# EasyEDA Pro project easy_eda_proj.eprj, schematic Schematic1
Board Name: Board1; Create Date: 2025-11-26; Page Name: P1; Project Name: musclemap_pcb_revised; Schematic Name: Schematic1; Update Date: 2025-12-25; Company: DWAN; Drawn: DWAN; Page Size: A4; Version: V1.0
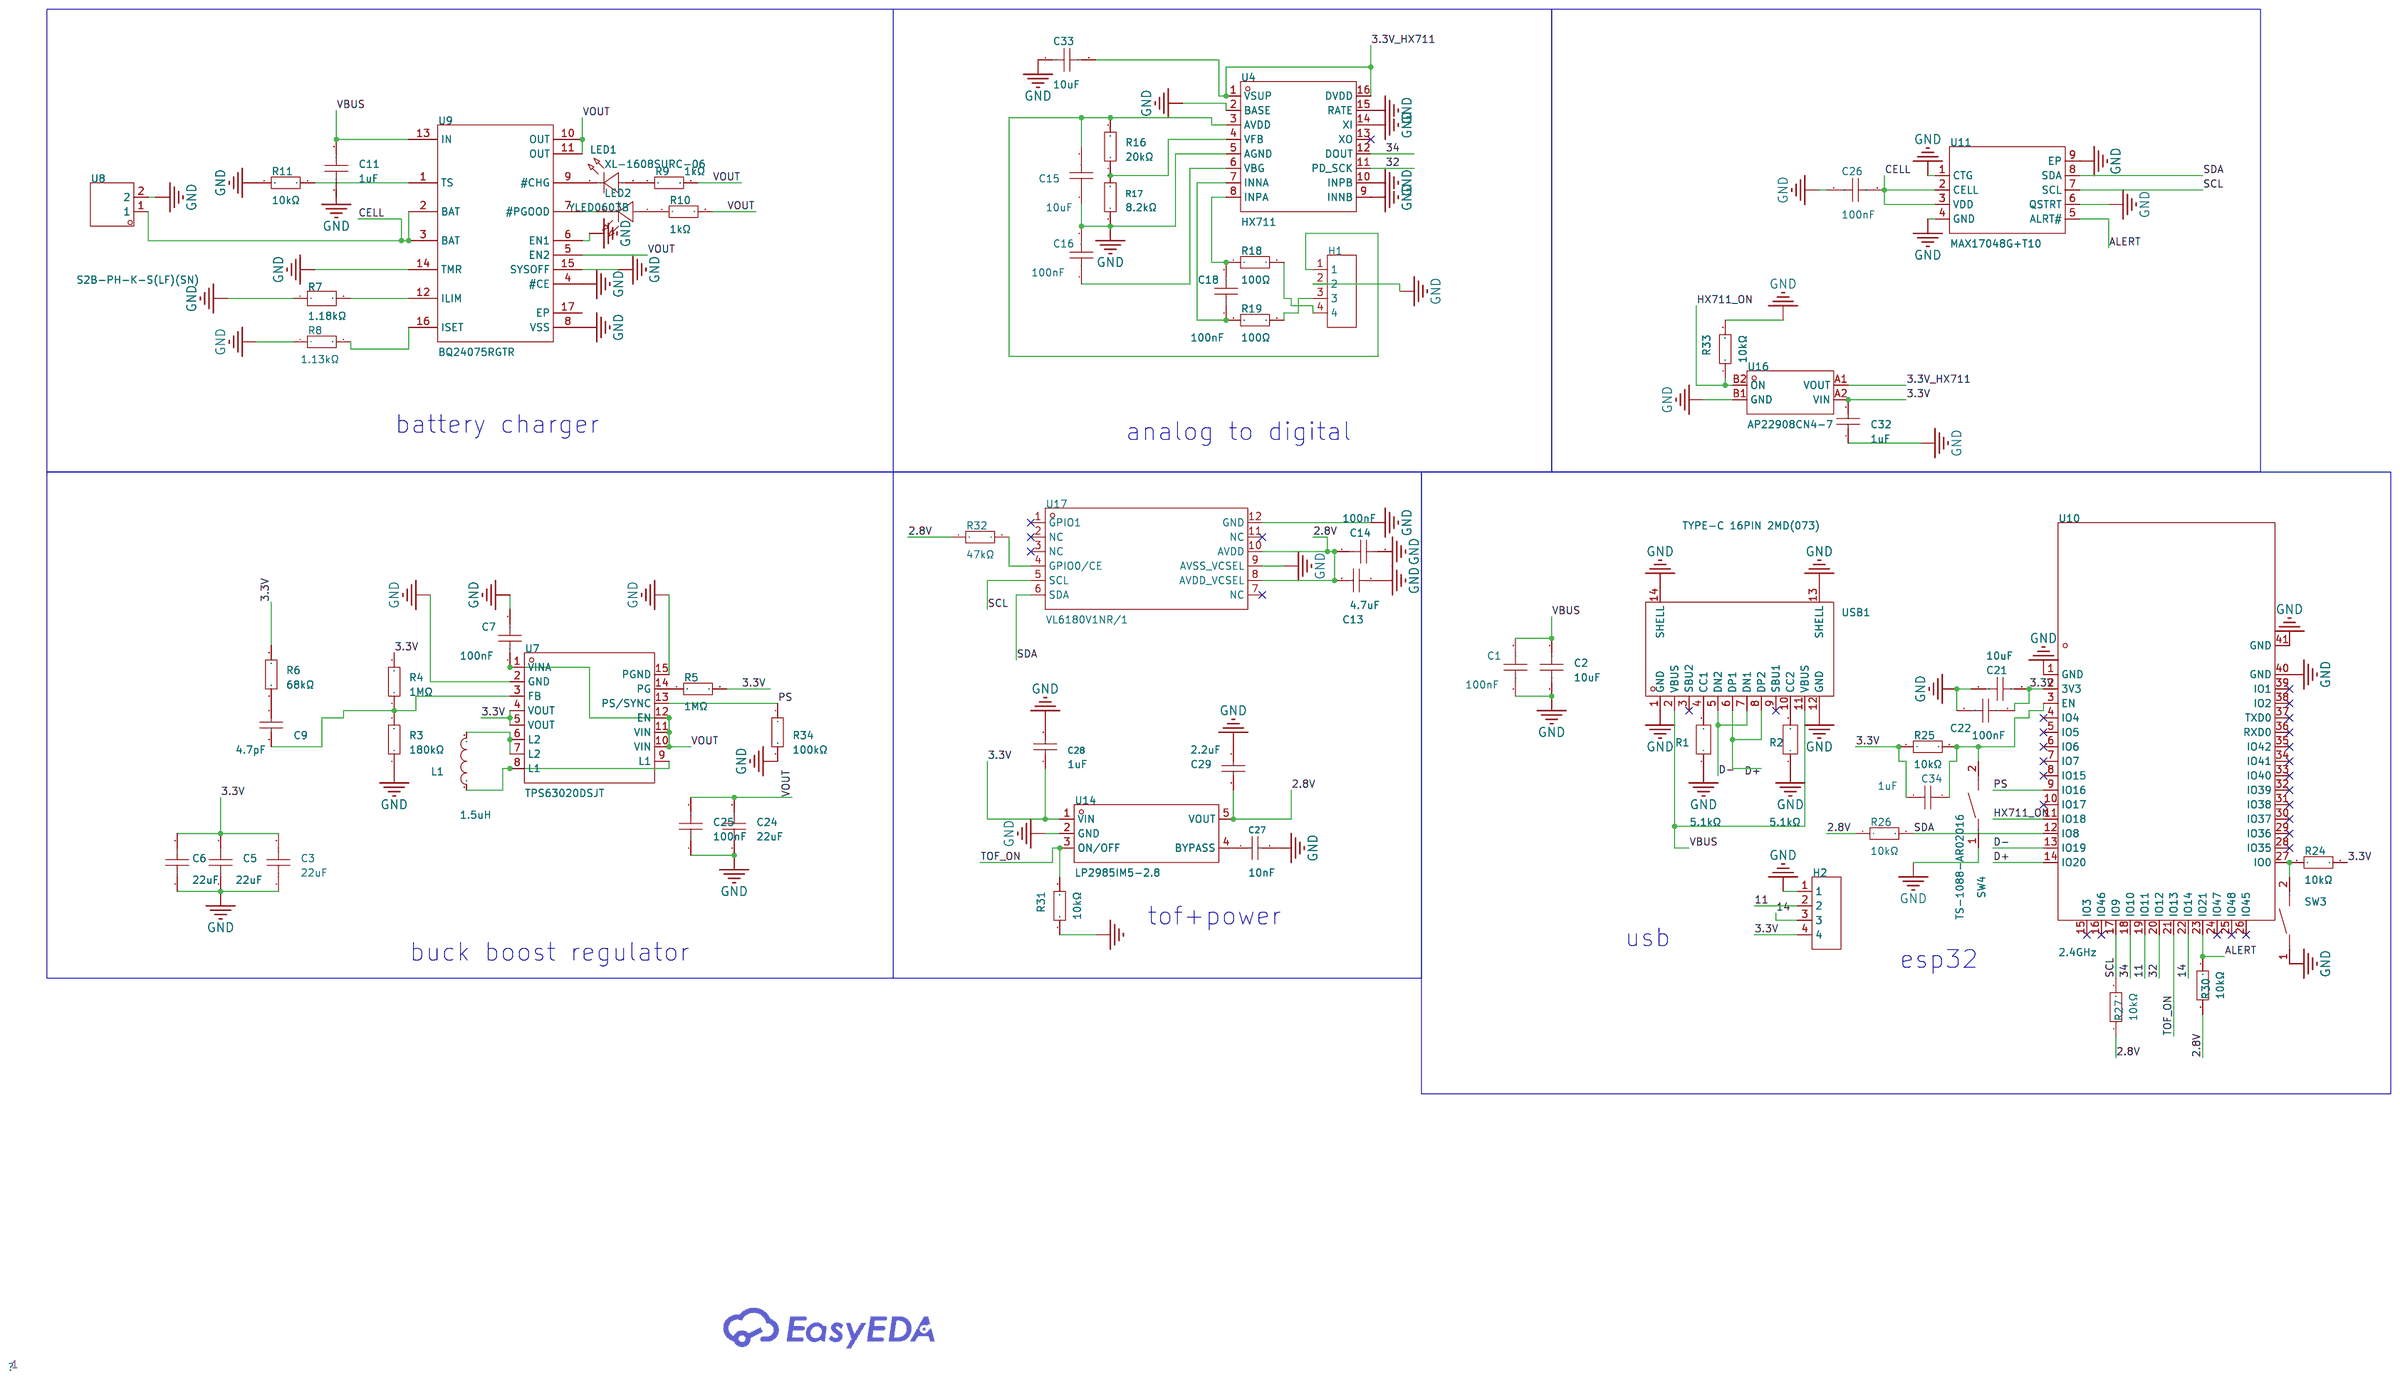
[diagram p0: schematic sheet]

## Parts
C1  100nF  [C0603]
C2  10uF  [C0805]
C3  22uF  [C0603]
C5  22uF  [C0603]
C6  22uF  [C0603]
C7  100nF  [C0603]
C9  4.7pF  [C0603]
C11  1uF  [C0603]
C13  4.7uF  [C0805]
C14  100nF  [C0603]
C15  10uF  [C0805]
C16  100nF  [C0603]
C18  100nF  [C0603]
C21  10uF  [C0805]
C22  100nF  [C0603]
C24  22uF  [C0603]
C25  100nF  [C0402]
C26  100nF  [C0603]
C27  10nF  [C0603]
C28  1uF  [C0805]
C29  2.2uF  [C0603]
C32  1uF  [C0402]
C33  10uF  [C0603]
C34  1uF  [C0402]
H1  -  [CONN-TH_B4B-XH-A-LF-SN]
H2  -  [CONN-TH_B4B-XH-A-LF-SN]
L1  1.5uH  [IND-SMD_L2.5-W2.0_MEKK2520TR47M]
LED1  XL-1608SURC-06  [LED0603-RD_RED]
LED2  YLED0603B  [LED0603-FD]
R1  5.1kΩ  [R0603]
R2  5.1kΩ  [R0603]
R3  180kΩ  [R0603]
R4  1MΩ  [R0603]
R5  1MΩ  [R0603]
R6  68kΩ  [R0603]
R7  1.18kΩ  [R0603]
R8  1.13kΩ  [R0603]
R9  1kΩ  [R0603]
R10  1kΩ  [R0603]
R11  10kΩ  [R0603]
R16  20kΩ  [R0603]
R17  8.2kΩ  [R0603]
R18  100Ω  [R0603]
R19  100Ω  [R0603]
R24  10kΩ  [R0603]
R25  10kΩ  [R0603]
R26  10kΩ  [R0603]
R27  10kΩ  [R0603]
R30  10kΩ  [R0603]
R31  10kΩ  [R0603]
R32  47kΩ  [R0603]
R33  10kΩ  [R0603]
R34  100kΩ  [R0402]
SW3  TS-1088-AR02016  [SW-SMD_L3.9-W3.0-P4.45]
SW4  TS-1088-AR02016  [SW-SMD_L3.9-W3.0-P4.45]
U4  HX711  [SOP-16_L10.0-W3.9-P1.27-LS6.0-BL]
U7  TPS63020DSJT  [VSON-14_L4.0-W3.0-P0.50-BL-EP_TI_DSJ]
U8  S2B-PH-K-S(LF)(SN)  [CONN-TH_S2B-PH-K-S-LF-SN]
U9  BQ24075RGTR  [QFN-16_L3.0-W3.0-P0.50-TL-EP1.7]
U10  2.4GHz  [WIRELM-SMD_ESP32-S3-WROOM-1]
U11  MAX17048G+T10  [TDFN-8_L2.0-W2.0-P0.50-BL-EP1.2]
U14  LP2985IM5-2.8  [SOT-23-5_L3.0-W1.6-P0.95-LS2.8-BR]
U16  AP22908CN4-7  [X1-WLB0909-4_L0.9-W0.9-R2-C2-P0.55-BR]
U17  VL6180V1NR/1  [LGA-12_L4.8-W2.8-P0.75-BL]
USB1  TYPE-C 16PIN 2MD(073)  [USB-C-SMD_TYPE-C-6PIN-2MD-073]

## Library data of the parts
C1 C7 C14 C16 C18 C22 C26 = CC0603KRX7R9BB104: Capacitance:100nF Tolerance:±10% Tolerance:±10% Voltage Rating:50V Temperature Coefficient:X7R; LCSC Part Name: 100nF ±10% 50V; Supplier Part: C14663; Manufacturer: YAGEO(国巨); Supplier Footprint: 0603; JLCPCB Part Class: Basic Part; Datasheet: https://item.szlcsc.com/datasheet/CC0603KRX7R9BB104/15331.html; Supplier: LCSC; Tolerance: ±10%; Voltage Rating: 50V; Temperature Coefficient: X7R
C2 C15 C21 = CL21A106KAYNNNE_C15850: Capacitance:10uF Tolerance:±10% Tolerance:±10% Voltage Rating:25V Temperature Coefficient:X5R; LCSC Part Name: 10uF ±10% 25V; Supplier Part: C15850; Manufacturer: SAMSUNG(三星); Manufacturer Part: CL21A106KAYNNNE; Supplier Footprint: 0805; JLCPCB Part Class: Basic Part; Datasheet: https://item.szlcsc.com/datasheet/CL21A106KAYNNNE/16532.html; Supplier: LCSC; Tolerance: ±10%; Voltage Rating: 25V; Temperature Coefficient: X5R
C3 C5 C6 C24 = CL10A226MP8NUNE: Capacitance:22uF Tolerance:±20% Tolerance:±20% Voltage Rating:10V Temperature Coefficient:X5R; LCSC Part Name: 22uF ±20% 10V; Supplier Part: C86295; Manufacturer: SAMSUNG(三星); Supplier Footprint: 0603; JLCPCB Part Class: Extended Part; Datasheet: https://item.szlcsc.com/datasheet/CL10A226MP8NUNE/87471.html; Supplier: LCSC; Tolerance: ±20%; Voltage Rating: 10V; Temperature Coefficient: X5R
C9 = 0603CG4R7C500NT: Capacitance:4.7pF Voltage Rating:50V Temperature Coefficient:C0G; LCSC Part Name: ±0.25pF 4.7pF 50V; Supplier Part: C1669; Manufacturer: FH(风华); Supplier Footprint: 0603; JLCPCB Part Class: Extended Part; Datasheet: https://item.szlcsc.com/datasheet/0603CG4R7C500NT/2021.html; Supplier: LCSC; Voltage Rating: 50V; Temperature Coefficient: C0G
C11 = CL10A105KB8NNNC: Capacitance:1uF Tolerance:±10% Tolerance:±10% Voltage Rating:50V Temperature Coefficient:X5R; LCSC Part Name: 1uF ±10% 50V; Supplier Part: C15849; Manufacturer: SAMSUNG(三星); Supplier Footprint: 0603; JLCPCB Part Class: Basic Part; Datasheet: https://item.szlcsc.com/datasheet/CL10A105KB8NNNC/16531.html; Supplier: LCSC; Tolerance: ±10%; Voltage Rating: 50V; Temperature Coefficient: X5R
C13 = CL21A475KBQNNNE: Capacitance:4.7uF Tolerance:±10% Tolerance:±10% Voltage Rating:50V Temperature Coefficient:X5R; LCSC Part Name: 4.7uF ±10% 50V; Supplier Part: C98192; Manufacturer: SAMSUNG(三星); Supplier Footprint: 0805; JLCPCB Part Class: Extended Part; Datasheet: https://item.szlcsc.com/datasheet/CL21A475KBQNNNE/99401.html; Supplier: LCSC; Tolerance: ±10%; Voltage Rating: 50V; Temperature Coefficient: X5R
C25 = CL05B104KO5NNNC: LCSC Part Name: 100nF ±10% 16V; Supplier Part: C1525; Manufacturer: SAMSUNG(三星); Supplier Footprint: 0402; JLCPCB Part Class: Basic Part; Datasheet: https://item.szlcsc.com/datasheet/CL05B104KO5NNNC/1877.html; Supplier: LCSC; Tolerance: ±10%; Voltage Rating: 16V; Temperature Coefficient: X7R
C27 = CC0603KRX7R9BB103: LCSC Part Name: 10nF ±10% 50V; Supplier Part: C100042; Manufacturer: YAGEO(国巨); Supplier Footprint: 0603; JLCPCB Part Class: Extended Part; Datasheet: https://item.szlcsc.com/datasheet/CC0603KRX7R9BB103/101256.html; Supplier: LCSC; Tolerance: ±10%; Voltage Rating: 50V; Temperature Coefficient: X7R
C28 = CL21B105KBFNNNE: LCSC Part Name: 1uF ±10% 50V; Supplier Part: C28323; Manufacturer: SAMSUNG(三星); Supplier Footprint: 0805; JLCPCB Part Class: Basic Part; Datasheet: https://item.szlcsc.com/datasheet/CL21B105KBFNNNE/29074.html; Supplier: LCSC; Tolerance: ±10%; Voltage Rating: 50V; Temperature Coefficient: X7R
C29 = CL10A225KO8NNNC: LCSC Part Name: 2.2uF ±10% 16V; Supplier Part: C23630; Manufacturer: SAMSUNG(三星); Supplier Footprint: 0603; JLCPCB Part Class: Basic Part; Datasheet: https://item.szlcsc.com/datasheet/CL10A225KO8NNNC/24366.html; Supplier: LCSC; Tolerance: ±10%; Voltage Rating: 16V; Temperature Coefficient: X5R
C32 C34 = CL05A105KP5NNNC: LCSC Part Name: 1uF ±10% 10V; Supplier Part: C14445; Manufacturer: SAMSUNG(三星); Supplier Footprint: 0402; JLCPCB Part Class: Extended Part; Datasheet: https://item.szlcsc.com/datasheet/CL05A105KP5NNNC/15107.html; Supplier: LCSC; Tolerance: ±10%; Voltage Rating: 10V; Temperature Coefficient: X5R
C33 = CL10A106KP8NNNC: LCSC Part Name: 10uF ±10% 10V; Supplier Part: C19702; Manufacturer: SAMSUNG(三星); Supplier Footprint: 0603; JLCPCB Part Class: Basic Part; Datasheet: https://item.szlcsc.com/datasheet/CL10A106KP8NNNC/20411.html; Supplier: LCSC; Tolerance: ±10%; Voltage Rating: 10V; Temperature Coefficient: X5R
H1 H2 = B4B-XH-A(LF)(SN): Reference Series:XH Pitch:2.5mm Pins Structure:1x4P Number of Rows:1 Number of PINs Per Row:4 Row Spacing:- Mounting Style:- Contact Material:Brass; LCSC Part Name: XH插座 1*4P 间距2.5mm 直针; Supplier Part: C144395; Manufacturer: JST; Supplier Footprint: 插件,P=2.5mm; JLCPCB Part Class: Extended Part; Datasheet: https://atta.szlcsc.com/upload/public/pdf/source/20180327/C144395_D58F0D17A3F58B29FECD1B7D0A791262.pdf; Supplier: LCSC; Reference Series: XH; Pitch: 2.5mm; Pins Structure: 1x4P; Number of Rows: 1; Number of PINs Per Row: 4; Contact Material: Brass
L1 = FTC252012S1R5MBCA: Inductance:1.5uH Tolerance:±20% Tolerance:±20% Current Rating:3.7A Current - Saturation(Isat):4.5A DC Resistance(DCR):44mΩ Type:-; LCSC Part Name: 1.5uH ±20% 4.5A; Supplier Part: C5832371; Manufacturer: cjiang(长江微电); Supplier Footprint: 1008; JLCPCB Part Class: Extended Part; Datasheet: https://item.szlcsc.com/datasheet/FTC252012S1R5MBCA/6763491.html; Supplier: LCSC; Tolerance: ±20%; Current Rating: 3.7A; Current - Saturation(Isat): 4.5A; DC Resistance(DCR): 44mΩ
LED1 = XL-1608SURC-06: Lamp Holder Type:- Illumination Color:Red Voltage - Forward(Vf):2.3V Voltage - Forward(Vf):2.3V Power(Watts):50mW Forward Current:20mA Wavelength - Dominant:620nm~630nm Wavelength - Dominant:620nm~630nm Peak Wavelength:625nm Diode Configuration:- Lens Col; LCSC Part Name: 0603红色贴片式发光二极管; Supplier Part: C965799; Manufacturer: XINGLIGHT(成兴光); Supplier Footprint: 0603; JLCPCB Part Class: Extended Part; Datasheet: https://item.szlcsc.com/datasheet/XL-1608SURC-06/1051408.html; Supplier: LCSC; Illumination Color: Red; Voltage - Forward(Vf): 2.3V; Power(Watts): 50mW; Forward Current: 20mA; Wavelength - Dominant: 620nm~630nm; Peak Wavelength: 625nm; Lens Color: Water Clear; Luminous Intensity: 225mcd; Viewing Angle: 120°; Mounting Style: op View Mount; Operating Temperature: -40℃~+85℃
LED2 = YLED0603B: Lamp Holder Type:-；- Illumination Color:Blue Voltage - Forward(Vf):2.6V~3.2V Voltage - Forward(Vf):2.6V~3.2V Power(Watts):- Forward Current:30mA Wavelength - Dominant:460nm~475nm Wavelength - Dominant:460nm~475nm Peak Wavelength:- Diode Configuration:Disc; LCSC Part Name: 蓝色 独立二极管; Supplier Part: C19171394; Manufacturer: YONGYUTAI(永裕泰); Supplier Footprint: 0603; JLCPCB Part Class: Extended Part; Datasheet: https://item.szlcsc.com/datasheet/YLED0603B/20382445.html; Supplier: LCSC; Lamp Holder Type: -；-; Illumination Color: Blue; Voltage - Forward(Vf): 2.6V~3.2V; Forward Current: 30mA; Wavelength - Dominant: 460nm~475nm; Diode Configuration: Discrete Diode; Lens Color: -；-; Luminous Intensity: 42mcd~86mcd; Viewing Angle: 120°; Mounting Style: -；-; Operating Temperature: -40℃~+85℃
R1 R2 = FRC0603F5101TS: Type:Thick Film Resistor Resistance:5.1kΩ Tolerance:±1% Tolerance:±1% Power(Watts):100mW Voltage-Supply(Max):75V Temperature Coefficient:±100ppm/℃ Temperature Coefficient:±100ppm/℃ Operating Temperature:-55℃~+155℃ Operating Temperature:-55℃~+155℃; LCSC Part Name: 5.1kΩ ±1% 100mW 厚膜电阻; Supplier Part: C2907044; Manufacturer: FOJAN(富捷); Supplier Footprint: 0603; JLCPCB Part Class: Extended Part; Supplier: LCSC; Type: Thick Film Resistor; Tolerance: ±1%; Power(Watts): 100mW; Voltage-Supply(Max): 75V; Temperature Coefficient: ±100ppm/℃; Operating Temperature: -55℃~+155℃
R3 = RC0603FR-07180KL: Type:Thick Film Resistors Resistance: Tolerance:±1% Tolerance:±1% Power(Watts): Overload Voltage (Max): Temperature Coefficient:±100ppm/℃ Temperature Coefficient:±100ppm/℃ Operating Temperature Range:-55℃~+155℃ Operating Temperature Range:-55℃~+155℃; LCSC Part Name: 厚膜电阻 180kΩ ±1% 100mW; Supplier Part: C123419; Manufacturer: YAGEO(国巨); Supplier Footprint: 0603; JLCPCB Part Class: Extended Part; Datasheet: https://atta.szlcsc.com/upload/public/pdf/source/20180821/C275644_0D56F95EFF785E7D9A1FEF436B37DA78.pdf; Supplier: LCSC; Type: Thick Film Resistors; Tolerance: ±1%; Temperature Coefficient: ±100ppm/℃; Operating Temperature Range: -55℃~+155℃
R4 R5 = RC0603FR-071ML: Type:Thick Film Resistors Resistance: Tolerance:±1% Tolerance:±1% Power(Watts): Overload Voltage (Max): Temperature Coefficient:±100ppm/℃ Temperature Coefficient:±100ppm/℃ Operating Temperature Range:-55℃~+155℃ Operating Temperature Range:-55℃~+155℃; LCSC Part Name: 厚膜电阻 1MΩ ±1% 100mW; Supplier Part: C105578; Manufacturer: YAGEO(国巨); Supplier Footprint: 0603; JLCPCB Part Class: Extended Part; Datasheet: https://atta.szlcsc.com/upload/public/pdf/source/20181102/C105578_67A9388250AF143DE4682E62257D2969.pdf; Supplier: LCSC; Type: Thick Film Resistors; Tolerance: ±1%; Temperature Coefficient: ±100ppm/℃; Operating Temperature Range: -55℃~+155℃
R6 = RC0603FR-0768KL: Type:Thick Film Resistor Resistance:68kΩ Tolerance:±1% Tolerance:±1% Power(Watts):100mW Voltage-Supply(Max):75V Temperature Coefficient:±100ppm/℃ Temperature Coefficient:±100ppm/℃ Operating Temperature:-55℃~+155℃ Operating Temperature:-55℃~+155℃; LCSC Part Name: 厚膜电阻 68kΩ ±1% 100mW; Supplier Part: C114633; Manufacturer: YAGEO(国巨); Supplier Footprint: 0603; JLCPCB Part Class: Extended Part; Datasheet: https://item.szlcsc.com/datasheet/RC0603FR-0768KL/115877.html; Supplier: LCSC; Type: Thick Film Resistor; Tolerance: ±1%; Power(Watts): 100mW; Voltage-Supply(Max): 75V; Temperature Coefficient: ±100ppm/℃; Operating Temperature: -55℃~+155℃
R7 = RT0603BRD071K18L: Type:Thin Film Resistor Resistance:1.18kΩ Tolerance:±0.1% Tolerance:±0.1% Power(Watts):100mW Voltage-Supply(Max):75V Temperature Coefficient:±25ppm/℃ Temperature Coefficient:±25ppm/℃ Operating Temperature:-55℃~+155℃ Operating Temperature:-55℃~+155℃; LCSC Part Name: 薄膜电阻 1.18kΩ ±0.1% 100mW; Supplier Part: C861193; Manufacturer: YAGEO(国巨); Supplier Footprint: 0603; JLCPCB Part Class: Extended Part; Datasheet: https://item.szlcsc.com/datasheet/RT0603BRD071K18L/921531.html; Supplier: LCSC; Type: Thin Film Resistor; Tolerance: ±0.1%; Power(Watts): 100mW; Voltage-Supply(Max): 75V; Temperature Coefficient: ±25ppm/℃; Operating Temperature: -55℃~+155℃
R8 = 0603WAF1131T5E: Type:Thick Film Resistor Resistance:1.13kΩ Tolerance:±1% Tolerance:±1% Power(Watts):100mW Voltage-Supply(Max):75V Temperature Coefficient:±100ppm/℃ Temperature Coefficient:±100ppm/℃ Operating Temperature:-55℃~+155℃ Operating Temperature:-55℃~+155℃; LCSC Part Name: 1.13kΩ ±1% 100mW 厚膜电阻; Supplier Part: C22833; Manufacturer: UNI-ROYAL(厚声); Supplier Footprint: 0603; JLCPCB Part Class: Extended Part; Datasheet: https://item.szlcsc.com/datasheet/0603WAF1131T5E/23560.html; Supplier: LCSC; Type: Thick Film Resistor; Tolerance: ±1%; Power(Watts): 100mW; Voltage-Supply(Max): 75V; Temperature Coefficient: ±100ppm/℃; Operating Temperature: -55℃~+155℃
R9 R10 = RC0603FR-071KL: Type:Thick Film Resistor Resistance:1kΩ Tolerance:±1% Tolerance:±1% Power(Watts):100mW Voltage-Supply(Max):75V Temperature Coefficient:±100ppm/℃ Temperature Coefficient:±100ppm/℃ Operating Temperature:-55℃~+155℃ Operating Temperature:-55℃~+155℃; LCSC Part Name: 厚膜电阻 1kΩ ±1% 100mW; Supplier Part: C22548; Manufacturer: YAGEO(国巨); Supplier Footprint: 0603; JLCPCB Part Class: Extended Part; Datasheet: https://item.szlcsc.com/datasheet/RC0603FR-071KL/23274.html; Supplier: LCSC; Type: Thick Film Resistor; Tolerance: ±1%; Power(Watts): 100mW; Voltage-Supply(Max): 75V; Temperature Coefficient: ±100ppm/℃; Operating Temperature: -55℃~+155℃
R11 R24-R27 R30 R31 R33 = RC0603FR-0710KL: Type:Thick Film Resistors Resistance: Tolerance:±1% Tolerance:±1% Power(Watts): Overload Voltage (Max): Temperature Coefficient:±100ppm/℃ Temperature Coefficient:±100ppm/℃ Operating Temperature Range:-55℃~+155℃ Operating Temperature Range:-55℃~+155℃; LCSC Part Name: 厚膜电阻 10kΩ ±1% 100mW; Supplier Part: C98220; Manufacturer: YAGEO(国巨); Supplier Footprint: 0603; JLCPCB Part Class: Extended Part; Datasheet: https://atta.szlcsc.com/upload/public/pdf/source/20180927/C295883_E8D83085EA81BD7DE0B2B681138C15EE.pdf; Supplier: LCSC; Type: Thick Film Resistors; Tolerance: ±1%; Temperature Coefficient: ±100ppm/℃; Operating Temperature Range: -55℃~+155℃
R16 = RC0603FR-0720KL: Type:Thick Film Resistor Resistance:20kΩ Tolerance:±1% Tolerance:±1% Power(Watts):100mW Voltage-Supply(Max):75V Temperature Coefficient:±100ppm/℃ Temperature Coefficient:±100ppm/℃ Operating Temperature:-55℃~+155℃ Operating Temperature:-55℃~+155℃; LCSC Part Name: 厚膜电阻 20kΩ ±1% 100mW; Supplier Part: C105575; Manufacturer: YAGEO(国巨); Supplier Footprint: 0603; JLCPCB Part Class: Extended Part; Datasheet: https://item.szlcsc.com/datasheet/RC0603FR-0720KL/106790.html; Supplier: LCSC; Type: Thick Film Resistor; Tolerance: ±1%; Power(Watts): 100mW; Voltage-Supply(Max): 75V; Temperature Coefficient: ±100ppm/℃; Operating Temperature: -55℃~+155℃
R17 = 0603WAF8201T5E: Type:Thick Film Resistor Resistance:8.2kΩ Tolerance:±1% Tolerance:±1% Power(Watts):100mW Voltage-Supply(Max):75V Temperature Coefficient:±100ppm/℃ Temperature Coefficient:±100ppm/℃ Operating Temperature:-55℃~+155℃ Operating Temperature:-55℃~+155℃; LCSC Part Name: 8.2kΩ ±1% 100mW 厚膜电阻; Supplier Part: C25981; Manufacturer: UNI-ROYAL(厚声); Supplier Footprint: 0603; JLCPCB Part Class: Basic Part; Datasheet: https://item.szlcsc.com/datasheet/0603WAF8201T5E/26724.html; Supplier: LCSC; Type: Thick Film Resistor; Tolerance: ±1%; Power(Watts): 100mW; Voltage-Supply(Max): 75V; Temperature Coefficient: ±100ppm/℃; Operating Temperature: -55℃~+155℃
R18 R19 = RC0603FR-07100RL: Type:Thick Film Resistors Resistance: Tolerance:±1% Tolerance:±1% Power(Watts): Overload Voltage (Max): Temperature Coefficient:±100ppm/℃ Temperature Coefficient:±100ppm/℃ Operating Temperature Range:-55℃~+155℃ Operating Temperature Range:-55℃~+155℃; LCSC Part Name: 厚膜电阻 100Ω ±1% 100mW; Supplier Part: C105588; Manufacturer: YAGEO(国巨); Supplier Footprint: 0603; JLCPCB Part Class: Extended Part; Datasheet: https://atta.szlcsc.com/upload/public/pdf/source/20180316/70C0E2BDAE7FCC62C531A5A58D202EE1.pdf; Supplier: LCSC; Type: Thick Film Resistors; Tolerance: ±1%; Temperature Coefficient: ±100ppm/℃; Operating Temperature Range: -55℃~+155℃
R32 = RC0603FR-0747KL: LCSC Part Name: 厚膜电阻 47kΩ ±1% 100mW; Supplier Part: C105579; Manufacturer: YAGEO(国巨); Supplier Footprint: 0603; JLCPCB Part Class: Extended Part; Datasheet: https://item.szlcsc.com/datasheet/RC0603FR-0747KL/106794.html; Supplier: LCSC; Type: Thick Film Resistor; Tolerance: ±1%; Power(Watts): 100mW; Voltage-Supply(Max): 75V; Temperature Coefficient: ±100ppm/℃; Operating Temperature: -55℃~+155℃
R34 = RC0402FR-07100KL: LCSC Part Name: 厚膜电阻 100kΩ ±1% 62.5mW; Supplier Part: C60491; Manufacturer: YAGEO(国巨); Supplier Footprint: 0402; JLCPCB Part Class: Extended Part; Datasheet: https://item.szlcsc.com/datasheet/RC0402FR-07100KL/61543.html; Supplier: LCSC; Type: Thick Film Resistor; Tolerance: ±1%; Power(Watts): 62.5mW; Voltage-Supply(Max): 50V; Temperature Coefficient: ±100ppm/℃; Operating Temperature: -55℃~+155℃
SW3 SW4 = TS-1088-AR02016: Circuit:SPST Actuator Style:Round Button Operating Force:1.6N Mounting Type:Surface Mount,Vertical Length:4mm Width:3mm Switch Height:2mm with Bracket:Without Bracket Contact Current:50mA Voltage Rating:12V Actuator/Cap Color:Black Termination Style:SMD(S; LCSC Part Name: 4*3*2mm 立贴 轻触开关; Supplier Part: C720477; Manufacturer: XUNPU(讯普); Supplier Footprint: SMD,4x3mm; JLCPCB Part Class: Basic Part; Datasheet: https://item.szlcsc.com/datasheet/TS-1088-AR02016/763484.html; Supplier: LCSC; Circuit: SPST; Actuator Style: Round Button; Operating Force: 1.6N; Mounting Type: Surface Mount,Vertical; Length: 4mm; Width: 3mm; Switch Height: 2mm; with Bracket: Without Bracket; Contact Current: 50mA; Voltage Rating: 12V; Actuator/Cap Color: Black; Termination Style: SMD(SMT) Tab; Life: 100,000 Cycles; Operating Temperature: -30℃~+80℃
U4 = HX711_C6705483: resolution:24Bit number of channels:2 Supply Voltage:2.7V~5.5V Supply Voltage:2.7V~5.5V differential input:Yes Integral nonlinearity:- Integral nonlinearity:- Operating Temperature:-40℃~+85℃ Operating Temperature:-40℃~+85℃; Supplier Part: C6705483; Manufacturer: AVIA(海芯科技); Supplier Footprint: SOP-16; JLCPCB Part Class: Extended Part; Datasheet: https://atta.szlcsc.com/upload/public/pdf/source/20240910/523FF17855B2F1313F971C77291F913D.pdf; Supplier: LCSC; resolution: 24Bit; number of channels: 2; Supply Voltage: 2.7V~5.5V; differential input: Yes; Operating Temperature: -40℃~+85℃
U7 = TPS63020DSJT: Function:Buck-Boost Output Type:- Voltage - Supply:1.8V~5.5V Voltage - Supply:1.8V~5.5V Output Voltage:- Output Voltage:- Output Current:- Frequency - Switching:2.4MHz Frequency - Switching:2.4MHz Operating Temperature:-40℃~+125℃@(TJ) Operating Temperatur; LCSC Part Name: 具有4A开关的高效率单电感器降压/升压转换器; Supplier Part: C544952; Manufacturer: TI(德州仪器); Supplier Footprint: VSON-14-EP(3x4); JLCPCB Part Class: Extended Part; Datasheet: https://www.ti.com/cn/lit/gpn/tps63021; Supplier: LCSC; Function: Buck-Boost; Voltage - Supply: 1.8V~5.5V; Frequency - Switching: 2.4MHz; Operating Temperature: -40℃~+125℃@(TJ); Synchronous Rectifier: Yes; Number of Outputs: 1; Topology: Buck-Boost; Switch tube (built-in/external): Built-In
U8 = S2B-PH-K-S(LF)(SN): Pins Structure:1x2P Pitch:2mm Mounting Type:Right Angle Reference Series:PH Number of Pins:2P Number of Rows:1 Number of PINs Per Row:2 Row Spacing:- Current Rating:2A Contact Material:Brass Contact Plating:Tin Operating Temperature:-25℃~+85℃ Operating Te; LCSC Part Name: 1x2P 间距:2mm 弯插 系列:PH; Supplier Part: C173752; Manufacturer: JST; Supplier Footprint: 弯插,P=2mm; JLCPCB Part Class: Extended Part; Datasheet: https://item.szlcsc.com/datasheet/S2B-PH-K-S(LF)(SN)/185142.html; Supplier: LCSC; Pins Structure: 1x2P; Pitch: 2mm; Mounting Type: Right Angle; Reference Series: PH; Number of Pins: 2P; Number of Rows: 1; Number of PINs Per Row: 2; Current Rating: 2A; Contact Material: Brass; Contact Plating: Tin; Operating Temperature: -25℃~+85℃; Voltage Rating: 100V; Plastic Material: PA66; Flame Retardant Rating: UL94V-0; Supplementary Features: K Pin; Color: White; Z-Height of the Board: 4.8mm; X-Length of Bottom Edge on Board (Spacing Line): 5.9mm; Y-Width of Bottom Edge on Board: 7.6mm
U9 = BQ24075RGTR: The Chip Type:Charging IC Voltage - Supply:4.35V~6.4V Voltage - Supply:4.35V~6.4V Charge Current - Max:1.5A Charging Saturation Voltage:4.2V Type of Battery:Lithium Battery Number of Cells:- Number of Cells:- Operating Temperature:-40℃~+125℃ Operating Tem; LCSC Part Name: 锂离子电池充电器和电源路径管理IC; Supplier Part: C15464; Manufacturer: TI(德州仪器); Supplier Footprint: QFN-16-EP(3x3); JLCPCB Part Class: Extended Part; Datasheet: http://www.ti.com/cn/lit/gpn/bq24075; Supplier: LCSC; The Chip Type: Charging IC; Voltage - Supply: 4.35V~6.4V; Charge Current - Max: 1.5A; Charging Saturation Voltage: 4.2V; Type of Battery: Lithium Battery; Operating Temperature: -40℃~+125℃; Battery Temperature Detection: Support; 0V Battery Charge: Not Supported
U10 = ESP32-S3-WROOM-1-N8R2: LCSC Part Name: 通用型Wi-Fi+低功耗蓝牙MCU模组; Supplier Part: C2913204; Manufacturer: ESPRESSIF(乐鑫); Supplier Footprint: SMD,25.5x18mm; JLCPCB Part Class: Extended Part; Datasheet: https://item.szlcsc.com/datasheet/ESP32-S3-WROOM-1-N8R2/3198302.html; Supplier: LCSC; Utilized IC / Part: ESP32-S3 Chip; Interface Type: SPI；I2S；USB；I2C；UART
U11 = MAX17048G+T10: LCSC Part Name: 单节/双节电池电量计使用ModelGauge技术; Supplier Part: C2682616; Manufacturer: ADI(亚德诺)/MAXIM(美信); Supplier Footprint: DFN-8-EP(2x2); JLCPCB Part Class: Extended Part; Datasheet: https://item.szlcsc.com/datasheet/MAX17048G%252BT10/2777647.html; Supplier: LCSC; The Chip Type: Battery monitoring chip; Voltage - Supply: 2.5V~4.5V; Type of Battery: Lithium-ion/Polymer; Number of Cells: 1; Operating Temperature: -40℃~+85℃
U14 = LP2985IM5-2.8: LCSC Part Name: 采用SOT-23封装的微功耗150 mA低噪声、超低压差稳压器，专为搭配超低ESR输出电容使用而设计; Supplier Part: C3750113; Manufacturer: TI(德州仪器); Supplier Footprint: SOT-23-5; JLCPCB Part Class: Extended Part; Datasheet: https://item.szlcsc.com/datasheet/LP2985IM5-2.8/4317640.html; Supplier: LCSC; Output Type: Fixed; Voltage - Supply: 16V; Output Voltage: 2.8V; Output Current: 150mA; Power Supply Rejection Ratio (PSRR): 45dB@(1kHz); Voltage Dropout: 575mV@(150mA); standby current: 850uA; Noise: 30uVrms; Features: Over Current Protection；Over Temperature Protection; Operating Temperature: -40℃~+125℃@(Tj); Output Configuration: Positive; Number of Outputs: 1
U16 = AP22908CN4-7_C5205186: Supplier Part: C5205186; Manufacturer: DIODES(美台); Supplier Footprint: XFBGA-4; JLCPCB Part Class: Extended Part; Datasheet: https://item.szlcsc.com/datasheet/AP22908CN4-7/5896549.html; Supplier: LCSC; Type: High Side Switch; Number of Channels: 1; Control Input Logic: Active High; Maximum Continuous Current: 1.5A; Voltage - Supply: 1.08V~3.6V; RDS(on): 28mΩ; Operating Temperature	-: -40℃~+85℃
U17 = VL6180V1NR/1: LCSC Part Name: I2C接口的接近传感器模块; Supplier Part: C2655167; Manufacturer: ST(意法半导体); Supplier Footprint: SMD-12P; JLCPCB Part Class: Extended Part; Datasheet: https://item.szlcsc.com/datasheet/VL6180V1NR%252F1/2747076.html; Supplier: LCSC; Voltage - Supply: 2.6V~3V; Linear Range: 0cm~62cm
USB1 = TYPE-C 16PIN 2MD(073): Connector Type:Type-C Protocol Standard:- Gender:Female Mounting Type:Surface Mount, Right Angle Number of Contacts:16P Number of Ports:1 Current Rating-Power:3A Voltage Rating:5V Connect-Disconnect Life:5,000 Cycles Supplementary Features:- Center Height; LCSC Part Name: Type-C 母 卧贴; Supplier Part: C2765186; Manufacturer: SHOU HAN(首韩); Supplier Footprint: SMD; JLCPCB Part Class: Extended Part; Datasheet: https://item.szlcsc.com/datasheet/TYPE-C%252016PIN%25202MD(073)/2901843.html; Supplier: LCSC; Connector Type: Type-C; Gender: Female; Mounting Type: Surface Mount, Right Angle; Number of Contacts: 16P; Number of Ports: 1; Current Rating-Power: 3A; Voltage Rating: 5V; Connect-Disconnect Life: 5,000 Cycles; Detection color: Black; Operating Temperature: -25℃~+85℃

## Nets
2.8V: C13.2 C14.2 C29.1 R26.1 R27.1 R30.1 R32.1 U14.5(VOUT) U17.8(AVDD_VCSEL) U17.10(AVDD)
3.3V: C3.2 C5.2 C6.2 C21.1 C22.1 C28.1 C32.2 C34.2 H2.4 R4.2 R5.2 R6.2 R24.2 R25.1 U7.4(VOUT) U7.5(VOUT) U10.2(3V3) U14.1(VIN) U16.A2(VIN)
3.3V_HX711: C33.2 U4.1(VSUP) U4.16(DVDD) U16.A1(VOUT)
GND: C1.1 C2.1 C3.1 C5.1 C6.1 C7.2 C11.1 C13.1 C14.1 C15.1 C16.2 C21.2 C22.2 C24.1 C25.1 C26.1 C27.2 C28.2 C29.2 C32.1 C33.1 H1.2 H2.1 R1.1 R2.1 R3.1 R7.1 R8.1 R11.1 R17.1 R31.1 R33.2 R34.2 SW3.1 SW4.1 U4.2(BASE) U4.5(AGND) U4.9(INNB) U4.10(INPB) U4.14(XI) U4.15(RATE) U7.2(GND) U7.15(PGND) U8.2 U9.4(#CE) U9.6(EN1) U9.8(VSS) U9.14(TMR) U9.15(SYSOFF) U10.1(GND) U10.40(GND) U10.41(GND) U11.1(CTG) U11.4(GND) U11.6(QSTRT) U11.9(EP) U14.2(GND) U16.B1(GND) U17.9(AVSS_VCSEL) U17.12(GND) USB1.1(GND) USB1.12(GND) USB1.13(SHELL) USB1.14(SHELL)
VBUS: C1.2 C2.2 C11.2 U9.13(IN) USB1.2(VBUS) USB1.11(VBUS)
11: H2.2 U10.19(IO11)
14: H2.3 U10.22(IO14)
32: U4.11(PD_SCK) U10.20(IO12)
34: U4.12(DOUT) U10.18(IO10)
ALERT: R30.2 U10.23(IO21) U11.5(ALRT#)
CELL: C26.2 U8.1 U9.2(BAT) U9.3(BAT) U11.2(CELL) U11.3(VDD)
D+: U10.14(IO20) USB1.6(DP1) USB1.8(DP2)
D-: U10.13(IO19) USB1.5(DN2) USB1.7(DN1)
HX711_ON: R33.1 U10.11(IO18) U16.B2(ON)
PS: R34.1 U7.13(PS/SYNC) U10.9(IO16)
SCL: R27.2 U10.17(IO9) U11.7(SCL) U17.5(SCL)
SDA: R26.2 U10.12(IO8) U11.8(SDA) U17.6(SDA)
TOF_ON: R31.2 U10.21(IO13) U14.3(ON/OFF)
VOUT: C7.1 C24.2 C25.2 R9.2 R10.2 U7.1(VINA) U7.10(VIN) U7.11(VIN) U7.12(EN) U9.5(EN2) U9.10(OUT) U9.11(OUT)
$1N1499: R1.2 USB1.4(CC1)
$1N1538: R2.2 USB1.10(CC2)
$1N2804: L1.1 U7.8(L1) U7.9(L1)
$1N2809: L1.2 U7.6(L2) U7.7(L2)
$1N2919: R5.1 U7.14(PG)
$1N3230: C9.1 R3.2 R4.1 U7.3(FB)
$1N3482: C9.2 R6.1
$1N4163: R7.2 U9.12(ILIM)
$1N4202: R8.2 U9.16(ISET)
$1N4584: LED1.1(K) U9.9(#CHG)
$1N4586: LED1.2(A) R9.1
$1N4675: LED2.2(K) U9.7(#PGOOD)
$1N4721: LED2.1(A) R10.1
$1N4792: R11.2 U9.1(TS)
$1N5724: R16.1 R17.2 U4.4(VFB)
$1N5746: C15.2 H1.1 R16.2 U4.3(AVDD)
$1N5829: C16.1 U4.6(VBG)
$1N6086: C18.2 R18.1 U4.8(INPA)
$1N6088: C18.1 R19.1 U4.7(INNA)
$1N6257: H1.4 R18.2
$1N6263: H1.3 R19.2
$1N25078: R24.1 SW3.2 U10.27(IO0)
$1N25329: C34.1 R25.2 SW4.2 U10.3(EN)
$1N40837: C27.1 U14.4(BYPASS)
$1N41276: R32.2 U17.4(GPIO0/CE)

Not connected (* = marked no-connect by the designer): U4 13(XO)*; U9 17(EP); U10 4(IO4)* 5(IO5)* 6(IO6)* 7(IO7)* 8(IO15)* 10(IO17)* 15(IO3)* 16(IO46)* 24(IO47)* 25(IO48)* 26(IO45)* 28(IO35)* 29(IO36)* 30(IO37)* 31(IO38)* 32(IO39)* 33(IO40)* 34(IO41)* 35(IO42)* 36(RXD0)* 37(TXD0)* 38(IO2)* 39(IO1)*; U17 1(GPIO1)* 2(NC)* 3(NC)* 7(NC)* 11(NC)*; USB1 3(SBU2)* 9(SBU1)*

## Notes on the sheet
- battery charger
- analog to digital
- tof+power
- usb
- buck boost regulator
- esp32
